# Altium schematic sheet 原理图.SchDoc
size A4
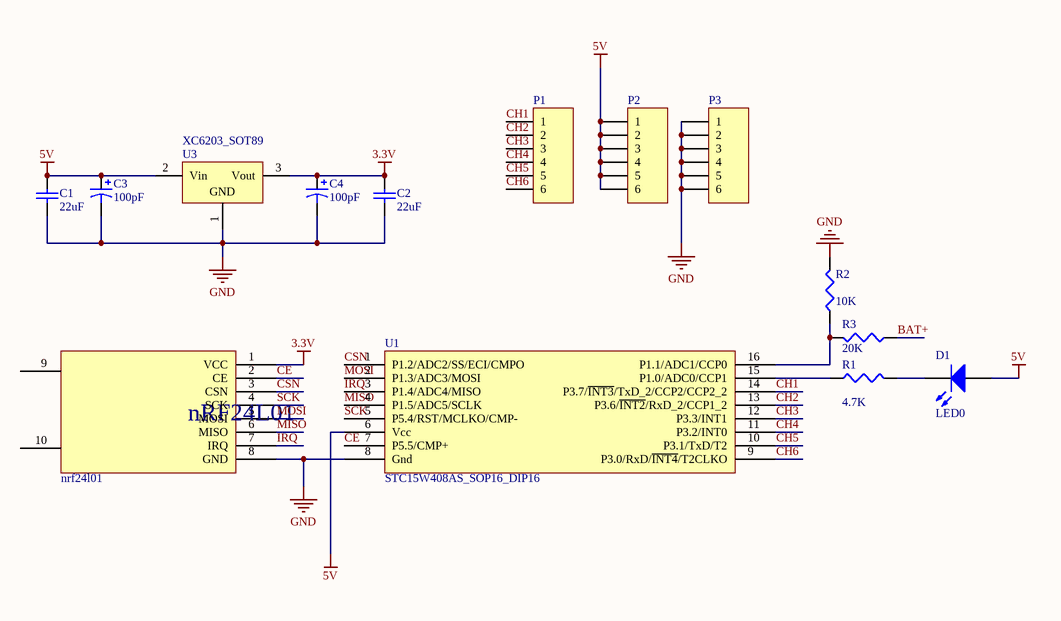
[diagram p0: 原理图.SchDoc]

## Parts
C1  value 22uF  [C 1210_L]  (hidden comment: Cap Semi)
C2  value 22uF  [C 1210_L]  (hidden comment: Cap Semi)
C3  value 100pF  [C 0805_L]  (hidden comment: Cap Pol3)
C4  value 100pF  [C 0805_L]  (hidden comment: Cap Pol3)
D1  LED0  [LED 0805B]
P1  Header 6  [HDR2.54-LI-6P]  (value not drawn)
P2  Header 6  [HDR2.54-LI-6P]  (value not drawn)
P3  Header 6  [HDR2.54-LI-6P]  (value not drawn)
R1  4.7K  [R 0805_L]
R2  value 10K  [R 0805_L]  (hidden comment: Res3)
R3  value 20K  [R 0805_L]  (hidden comment: Res3)
U1  STC15W408AS_SOP16_DIP16  [SOP16_N]
U2  nrf24l01  [nRF24L01]
U3  XC6203_SOT89  [SOT89_N]

## Nets
3.3V: C2.2 C4.1 U2.1(VCC) U3.3(Vout)
5V: C1.2 C3.1 D1.1(A) P2.1 P2.2 P2.3 P2.4 P2.5 P2.6 U1.6(Vcc) U3.2(Vin)
GND: C1.1 C2.1 C3.2 C4.2 P3.1 P3.2 P3.3 P3.4 P3.5 P3.6 R2.2 U1.8(Gnd) U2.8(GND) U3.1(GND)
BAT+: R3.1
CE: U1.7(P5.5/CMP+) U2.2(CE)
CH1: P1.1 U1.14(P3.7/~{INT3}/TxD_2/CCP2/CCP2_2)
CH2: P1.2 U1.13(P3.6/~{INT2}/RxD_2/CCP1_2)
CH3: P1.3 U1.12(P3.3/INT1)
CH4: P1.4 U1.11(P3.2/INT0)
CH5: P1.5 U1.10(P3.1/TxD/T2)
CH6: P1.6 U1.9(P3.0/RxD/~{INT4}/T2CLKO)
CSN: U1.1(P1.2/ADC2/SS/ECI/CMPO) U2.3(CSN)
IRQ: U1.3(P1.4/ADC4/MISO) U2.7(IRQ)
MISO: U1.4(P1.5/ADC5/SCLK) U2.6(MISO)
MOSI: U1.2(P1.3/ADC3/MOSI) U2.5(MOSI)
SCK: U1.5(P5.4/RST/MCLKO/CMP-) U2.4(SCK)
NetD1_2: D1.2(K) R1.2
NetR1_1: R1.1 U1.15(P1.0/ADC0/CCP1)
NetR2_1: R2.1 R3.2 U1.16(P1.1/ADC1/CCP0)

Not connected (* = marked no-connect by the designer): U2 9 10

## Notes on the sheet
- (in symbol nrf24l01) nRF24L01

## Library data of the parts
C1 C2 = Cap Semi: Capacitor (Semiconductor SIM Model); Published: 8-Jun-2000; LatestRevisionDate: 29-May-2009; LatestRevisionNote: IPC-7351 Footprint Added.; PackageReference: C1206; Publisher: Altium Limited; PackageDescription: Chip Capacitor
C3 C4 = Cap Pol3: Polarized Capacitor (Surface Mount); Published: 8-Jun-2000; LatestRevisionDate: 29-May-2009; LatestRevisionNote: IPC-7351 Footprint Added.; PackageReference: C0805; Publisher: Altium Limited; PackageDescription: Chip Capacitor
D1 = LED0: Typical INFRARED GaAs LED; Published: 8-Jun-2000; LatestRevisionDate: 08-Jul-2005; LatestRevisionNote: Mech Layer 1 removed.; PackageReference: LED-0; Publisher: Altium Limited; PackageDescription: LED; 2 Leads
P1-P3 = Header 6: Header, 6-Pin; LatestRevisionDate: 17-Jul-2002; LatestRevisionNote: Re-released for DXP Platform.; Publisher: Altium Limited
R1-R3 = Res3: Resistor; Published: 8-Jun-2000; LatestRevisionDate: 29-May-2009; LatestRevisionNote: IPC-7351 Footprint Added.; PackageReference: J1-0603; Publisher: Altium Limited; PackageDescription: Chip Resistor
  R1: Value: 4.7K
U1 = STC15W401AS_SOP16_DIP16
U3 = Volt Reg: Voltage Regulator; Published: 24-Mar-1999; LatestRevisionDate: 29-May-2009; LatestRevisionNote: IPC-7351 Footprint Added.; PackageReference: D2PAK; Publisher: Altium Limited; PackageDescription: 3-Pin Transistor Outline Package 2.54 mm Pitch, 15.1 mm Lead Span